# EAGLE design mic4606_power (EAGLE 6.4)

## Sheet 1 of 3
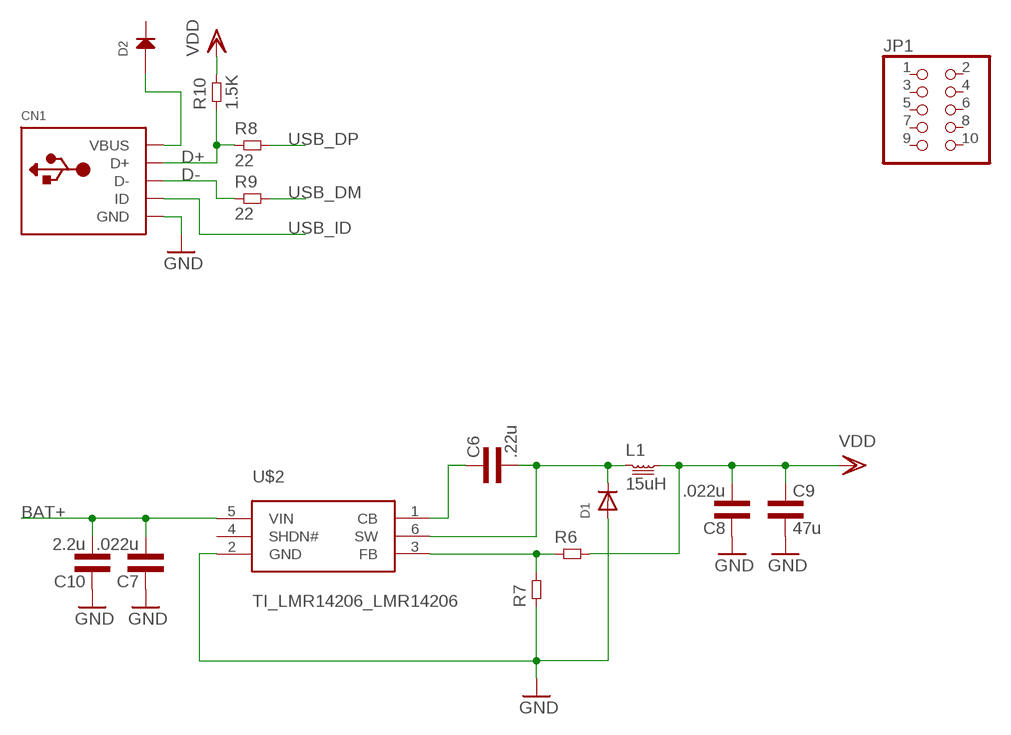
[diagram p0: schematic, sheet 1]

### Parts
C6  .22u  CAP0603L3  [0603L3]
C7  .022u  CAP0603L3  [0603L3]
C8  .022u  CAP0603L3  [0603L3]
C9  47u  CAP1210L3  [1210L3]
C10  2.2u  CAP1210L3  [1210L3]
CN1  USBMINIB  [USB-MINIB]
D1  ADAFRUIT_DIODESMA  [ADAFRUIT_SMADIODE]
D2  DIODEDO-214AC  [DO-214AC]
JP1  PINHD-2X5  [2X05]
L1  15uH  NRG4026  [NR4026]
R6  RES0603L3  [0603L3]
R7  RES0603L3  [0603L3]
R8  22  RES0402L3  [0402L3]
R9  22  RES0402L3  [0402L3]
R10  1.5K  RES0402L3  [0402L3]
U$2  TI_LMR14206_LMR14206  [TI_LMR14206_R-PDSO-G6]

### Nets
BAT+: C7.P$2 C10.P$2 U$2.5(VIN) ; also sheet 2
CB: C6.P$1 U$2.1(CB)
D+: CN1.D+ R8.P$1 R10.P$1
D-: CN1.D- R9.P$1
FB: R6.P$1 R7.P$2 U$2.3(FB)
GND: C7.P$1 C8.P$1 C9.P$2 C10.P$1 CN1.GND D1.A R7.P$1 U$2.2(GND) ; also sheet 2,3
SW: C6.P$2 D1.C L1.E U$2.6(SW)
USB_DM: R9.P$2 ; also sheet 3
USB_DP: R8.P$2 ; also sheet 3
USB_ID: CN1.ID ; also sheet 3
VBUS: CN1.VBUS D2.1(ANODE)
VDD: C8.P$2 C9.P$1 L1.F R6.P$2 R10.P$2 ; also sheet 3
Unconnected: D2.2(CATHODE) JP1.1 JP1.2 JP1.3 JP1.4 JP1.5 JP1.6 JP1.7 JP1.8 JP1.9 JP1.10 U$2.4(SHDN#)

## Sheet 2 of 3
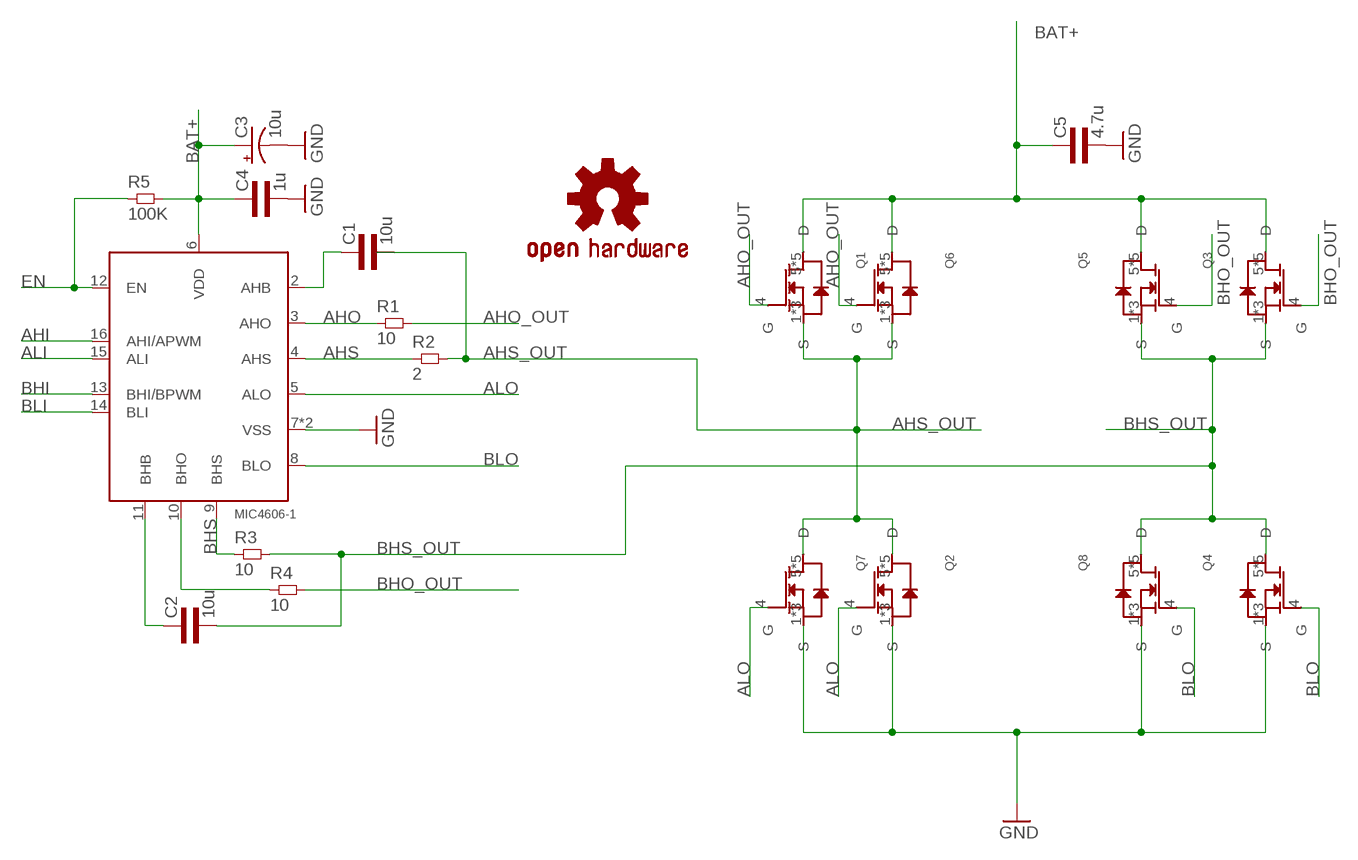
[diagram p1: schematic, sheet 2]

### Parts
C1  10u  CAP0805L3  [0805L3]
C2  10u  CAP0805L3  [0805L3]
C3  10u  CPOL-USE1.8-4  [E1,8-4]
C4  1u  CAP0603L3  [0603L3]
C5  4.7u  CAP0805L3  [0805L3]
LOGO1  OSHW-LOGOM  [OSHW-LOGO-M]
MD1  MIC4606-1  [QFN44-16LD-PL-2]
Q1  CSD18540Q5B  [Q5B]
Q2  CSD18540Q5B  [Q5B]
Q3  CSD18540Q5B  [Q5B]
Q4  CSD18540Q5B  [Q5B]
Q5  CSD18540Q5B  [Q5B]
Q6  CSD18540Q5B  [Q5B]
Q7  CSD18540Q5B  [Q5B]
Q8  CSD18540Q5B  [Q5B]
R1  10  RES0805L3  [0805L3]
R2  2  RES0805L3  [0805L3]
R3  10  RES0805L3  [0805L3]
R4  10  RES0805L3  [0805L3]
R5  100K  RES0603L3  [0603L3]

### Nets
AHI: MD1.16(AHI/APWM)
AHO: MD1.3(AHO) R1.1
AHO_OUT: Q1.4(G) Q6.4(G) R1.2
AHS: MD1.4(AHS) R2.1
AHS_OUT: C1.2 Q1.1(S) Q1.2(S) Q1.3(S) Q2.5(D) Q2.6(D) Q2.7(D) Q2.8(D) Q2.9(D) Q6.1(S) Q6.2(S) Q6.3(S) Q7.5(D) Q7.6(D) Q7.7(D) Q7.8(D) Q7.9(D) R2.2
ALI: MD1.15(ALI)
ALO: MD1.5(ALO) Q2.4(G) Q7.4(G)
BAT+: C3.+ C4.P$1 C5.1 MD1.6(VDD) Q1.5(D) Q1.6(D) Q1.7(D) Q1.8(D) Q1.9(D) Q3.5(D) Q3.6(D) Q3.7(D) Q3.8(D) Q3.9(D) Q5.5(D) Q5.6(D) Q5.7(D) Q5.8(D) Q5.9(D) Q6.5(D) Q6.6(D) Q6.7(D) Q6.8(D) Q6.9(D) R5.P$2 ; also sheet 1
BHI: MD1.13(BHI/BPWM)
BHO: MD1.10(BHO) R4.1
BHO_OUT: Q3.4(G) Q5.4(G) R4.2
BHS: MD1.9(BHS) R3.1
BHS_OUT: C2.2 Q3.1(S) Q3.2(S) Q3.3(S) Q4.5(D) Q4.6(D) Q4.7(D) Q4.8(D) Q4.9(D) Q5.1(S) Q5.2(S) Q5.3(S) Q8.5(D) Q8.6(D) Q8.7(D) Q8.8(D) Q8.9(D) R3.2
BLI: MD1.14(BLI)
BLO: MD1.8(BLO) Q4.4(G) Q8.4(G)
EN: MD1.12(EN) R5.P$1
GND: C3.- C4.P$2 C5.2 MD1.7(VSS) MD1.TP(VSS) Q2.1(S) Q2.2(S) Q2.3(S) Q4.1(S) Q4.2(S) Q4.3(S) Q7.1(S) Q7.2(S) Q7.3(S) Q8.1(S) Q8.2(S) Q8.3(S) ; also sheet 1,3
N$1: C1.1 MD1.2(AHB)
N$9: C2.1 MD1.11(BHB)

## Sheet 3 of 3
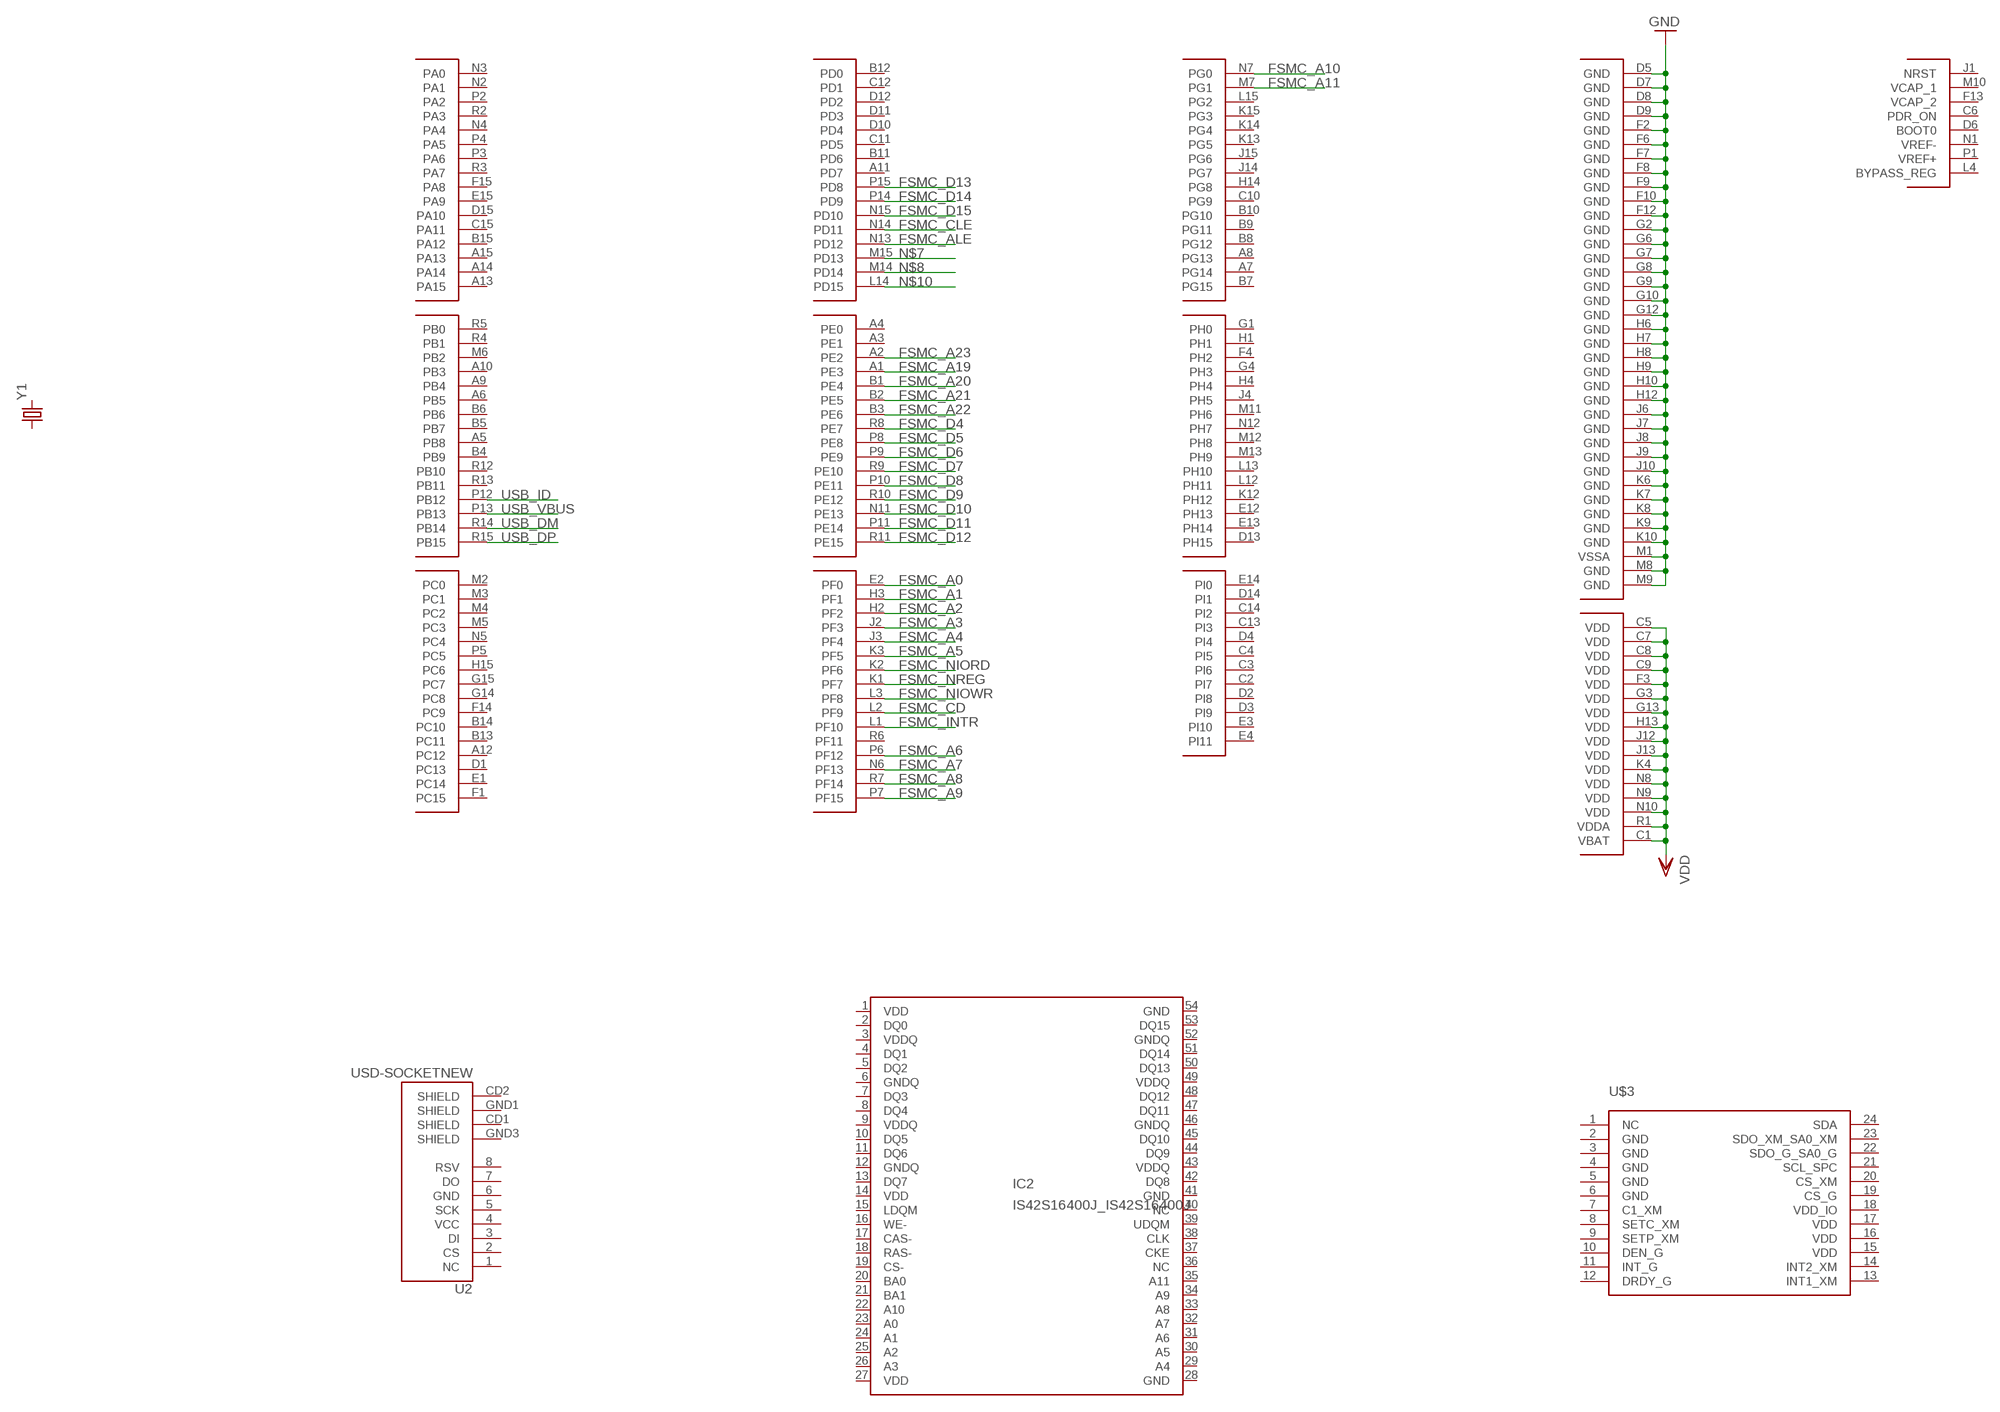
[diagram p2: schematic, sheet 3]

### Parts
IC2  IS42S16400J_IS42S16400J  [IS42S16400J_TSOP-2]
U2  USD-SOCKETNEW  [MICRO-SD-SOCKET-PP]
U$3  ST_LSM9DS0_TEMP_SENSE_LSM9DS0  [ST_LSM9DS0_TEMP_SENSE_LGA-24]
U$4  STM32_32BIT_MCU_STM32F407IG  [STM32_32BIT_MCU_UFBGA176+25]
Y1  CRYSTALHC49US  [HC49US]

### Nets
FSMC_A0: U$4.E2(PF0)
FSMC_A1: U$4.H3(PF1)
FSMC_A2: U$4.H2(PF2)
FSMC_A3: U$4.J2(PF3)
FSMC_A4: U$4.J3(PF4)
FSMC_A5: U$4.K3(PF5)
FSMC_A6: U$4.P6(PF12)
FSMC_A7: U$4.N6(PF13)
FSMC_A8: U$4.R7(PF14)
FSMC_A9: U$4.P7(PF15)
FSMC_A10: U$4.N7(PG0)
FSMC_A11: U$4.M7(PG1)
FSMC_A19: U$4.A1(PE3)
FSMC_A20: U$4.B1(PE4)
FSMC_A21: U$4.B2(PE5)
FSMC_A22: U$4.B3(PE6)
FSMC_A23: U$4.A2(PE2)
FSMC_ALE: U$4.N13(PD12)
FSMC_CD: U$4.L2(PF9)
FSMC_CLE: U$4.N14(PD11)
FSMC_D4: U$4.R8(PE7)
FSMC_D5: U$4.P8(PE8)
FSMC_D6: U$4.P9(PE9)
FSMC_D7: U$4.R9(PE10)
FSMC_D8: U$4.P10(PE11)
FSMC_D9: U$4.R10(PE12)
FSMC_D10: U$4.N11(PE13)
FSMC_D11: U$4.P11(PE14)
FSMC_D12: U$4.R11(PE15)
FSMC_D13: U$4.P15(PD8)
FSMC_D14: U$4.P14(PD9)
FSMC_D15: U$4.N15(PD10)
FSMC_INTR: U$4.L1(PF10)
FSMC_NIORD: U$4.K2(PF6)
FSMC_NIOWR: U$4.L3(PF8)
FSMC_NREG: U$4.K1(PF7)
GND: U$4.D5(GND) U$4.D7(GND) U$4.D8(GND) U$4.D9(GND) U$4.F2(GND) U$4.F6(GND) U$4.F7(GND) U$4.F8(GND) U$4.F9(GND) U$4.F10(GND) U$4.F12(GND) U$4.G2(GND) U$4.G6(GND) U$4.G7(GND) U$4.G8(GND) U$4.G9(GND) U$4.G10(GND) U$4.G12(GND) U$4.H6(GND) U$4.H7(GND) U$4.H8(GND) U$4.H9(GND) U$4.H10(GND) U$4.H12(GND) U$4.J6(GND) U$4.J7(GND) U$4.J8(GND) U$4.J9(GND) U$4.J10(GND) U$4.K6(GND) U$4.K7(GND) U$4.K8(GND) U$4.K9(GND) U$4.K10(GND) U$4.M1(VSSA) U$4.M8(GND) U$4.M9(GND) ; also sheet 1,2
N$7: U$4.M15(PD13)
N$8: U$4.M14(PD14)
N$10: U$4.L14(PD15)
USB_DM: U$4.R14(PB14) ; also sheet 1
USB_DP: U$4.R15(PB15) ; also sheet 1
USB_ID: U$4.P12(PB12) ; also sheet 1
USB_VBUS: U$4.P13(PB13)
VDD: U$4.C1(VBAT) U$4.C5(VDD) U$4.C7(VDD) U$4.C8(VDD) U$4.C9(VDD) U$4.F3(VDD) U$4.G3(VDD) U$4.G13(VDD) U$4.H13(VDD) U$4.J12(VDD) U$4.J13(VDD) U$4.K4(VDD) U$4.N8(VDD) U$4.N9(VDD) U$4.N10(VDD) U$4.R1(VDDA) ; also sheet 1
Unconnected: IC2.2(DQ0) IC2.4(DQ1) IC2.5(DQ2) IC2.7(DQ3) IC2.8(DQ4) IC2.10(DQ5) IC2.11(DQ6) IC2.13(DQ7) IC2.15(LDQM) IC2.16(WE-) IC2.17(CAS-) IC2.18(RAS-) IC2.19(CS-) IC2.20(BA0) IC2.21(BA1) IC2.22(A10) IC2.23(A0) IC2.24(A1) IC2.25(A2) IC2.26(A3) IC2.29(A4) IC2.30(A5) IC2.31(A6) IC2.32(A7) IC2.33(A8) IC2.34(A9) IC2.35(A11) IC2.36(NC) IC2.37(CKE) IC2.38(CLK) IC2.39(UDQM) IC2.40(NC) IC2.42(DQ8) IC2.44(DQ9) IC2.45(DQ10) IC2.47(DQ11) IC2.48(DQ12) IC2.50(DQ13) IC2.51(DQ14) IC2.53(DQ15) U2.1(NC) U2.2(CS) U2.3(DI) U2.4(VCC) U2.5(SCK) U2.6(GND) U2.7(DO) U2.8(RSV) U2.CD1(SHIELD) U2.CD2(SHIELD) U2.GND1(SHIELD) U2.GND3(SHIELD) U$3.1(NC) U$3.2(GND) U$3.3(GND) U$3.4(GND) U$3.5(GND) U$3.6(GND) U$3.7(C1_XM) U$3.8(SETC_XM) U$3.9(SETP_XM) U$3.10(DEN_G) U$3.11(INT_G) U$3.12(DRDY_G) U$3.13(INT1_XM) U$3.14(INT2_XM) U$3.15(VDD) U$3.16(VDD) U$3.17(VDD) U$3.18(VDD_IO) U$3.19(CS_G) U$3.20(CS_XM) U$3.21(SCL_SPC) U$3.22(SDO_G_SA0_G) U$3.23(SDO_XM_SA0_XM) U$3.24(SDA) U$4.A3(PE1) U$4.A4(PE0) U$4.A5(PB8) U$4.A6(PB5) U$4.A7(PG14) U$4.A8(PG13) U$4.A9(PB4) U$4.A10(PB3) U$4.A11(PD7) U$4.A12(PC12) U$4.A13(PA15) U$4.A14 U$4.A15(PA13) U$4.B4(PB9) U$4.B5(PB7) U$4.B6 U$4.B7(PG15) U$4.B8(PG12) U$4.B9(PG11) U$4.B10(PG10) U$4.B11(PD6) U$4.B12(PD0) U$4.B13(PC11) U$4.B14(PC10) U$4.B15(PA12) U$4.C2(PI7) U$4.C3(PI6) U$4.C4(PI5) U$4.C6(PDR_ON) U$4.C10(PG9) U$4.C11(PD5) U$4.C12(PD1) U$4.C13(PI3) U$4.C14(PI2) U$4.C15(PA11) U$4.D1(PC13) U$4.D2(PI8) U$4.D3(PI9) U$4.D4(PI4) U$4.D6(BOOT0) U$4.D10(PD4) U$4.D11(PD3) U$4.D12(PD2) U$4.D13(PH15) U$4.D14(PI1) U$4.D15(PA10) U$4.E1(PC14) U$4.E3(PI10) U$4.E4(PI11) U$4.E12(PH13) U$4.E13(PH14) U$4.E14(PI0) U$4.E15(PA9) U$4.F1(PC15) U$4.F4(PH2) U$4.F13(VCAP_2) U$4.F14(PC9) U$4.F15(PA8) U$4.G1(PH0) U$4.G4(PH3) U$4.G14(PC8) U$4.G15(PC7) U$4.H1 U$4.H4 U$4.H14(PG8) U$4.H15(PC6) U$4.J1(NRST) U$4.J4(PH5) U$4.J14(PG7) U$4.J15(PG6) U$4.K12(PH12) U$4.K13(PG5) U$4.K14(PG4) U$4.K15(PG3) U$4.L4(BYPASS_REG) U$4.L12(PH11) U$4.L13(PH10) U$4.L15(PG2) U$4.M2(PC0) U$4.M3(PC1) U$4.M4(PC2) U$4.M5(PC3) U$4.M6(PB2) U$4.M10(VCAP_1) U$4.M11(PH6) U$4.M12(PH8) U$4.M13(PH9) U$4.N1(VREF-) U$4.N2(PA1) U$4.N3(PA0) U$4.N4(PA4) U$4.N5(PC4) U$4.N12(PH7) U$4.P1(VREF+) U$4.P2(PA2) U$4.P3(PA6) U$4.P4(PA5) U$4.P5(PC5) U$4.R2(PA3) U$4.R3(PA7) U$4.R4(PB1) U$4.R5(PB0) U$4.R6(PF11) U$4.R12(PB10) U$4.R13(PB11) Y1.1 Y1.2

## Power pins joined to a net without a drawn wire
GND: IC2.28(GND) IC2.41(GND) IC2.54(GND)
GNDQ: IC2.6(GNDQ) IC2.12(GNDQ) IC2.46(GNDQ) IC2.52(GNDQ)
VDD: IC2.1(VDD) IC2.14(VDD) IC2.27(VDD)
VDDQ: IC2.3(VDDQ) IC2.9(VDDQ) IC2.43(VDDQ) IC2.49(VDDQ)

## Library data of the parts
C1 C2 C4-C10 = common:CAP
C3 = rcl:CPOL-US: POLARIZED CAPACITOR, American symbol
CN1 = adafruit:USB: USB Connectors USBMINIB - Surface Mount Female Mini-B USB Connector 4UConnector: 06564 By microbuilder.eu Thru-hole RA Female Mini-B USB Connector 4UConnector: 18732 By ladyada.net
D1 = logic_vB:ADAFRUIT_DIODE: Diode SMADIODE - SMA Surface Mount Package 20V 1A Schottky Diode Digikey: 641-1014-6-ND DO-1N4148 - Through Hole Small Current Diode SOD-123 20V 1 A (.5mV Vf) Schottky Diode - Digikey: MBRX120TPMSCT-ND SOD-323 10V 570mA (.38mV Vf, 3ns) Schottky Diode - Digikey: ZLLS410CT-ND SOD-523 30V 30mA Schottky Diode (RB751S-40TE61) - Digikey: RB751S-40TE61CT-ND SOT23-R/W - SOT23 Package (R = Solder Paste/Reflow Ovens, W = Hand-Soldering) BAT54Film 40V 300mA - Digikey: 497-7162-1-ND
D2 = common:DIODE
IC2 = Logic - Copy:IS42S16400J_IS42S16400J: edit this description Auto generated by make-symbol-device-package-bsdl.ulp Rev. 43 Source:
JP1 = pinhead:PINHD-2X5: PIN HEADER
L1 = common:NRG4026
LOGO1 = SparkFun-Aesthetics:OSHW-LOGO: Open Source Hardware Logo This logo indicates the piece of hardware it is found on incorporates a OSHW license and/or adheres to the definition of open source hardware found here: http://freedomdefined.org/OSHW
MD1 = common:MIC4606: 85V Full-Bridge Mosfet Driver
Q1-Q8 = common:CSD18540Q5B: N-Channel High-Power MosFET; I_MAX: 221A; PD: 195W; PULSED_DRAIN_CURRENT: 400A; VGS: +/- 20V; V_MAX: 60V
R1-R10 = common:RES
U2 = SparkFun-Connectors:USD-SOCKET: microSD Socket Push-push type uSD socket. Schematic element and footprint production proven. Spark Fun Electronics SKU : PRT-00127. tDoc lines correctly indicate media card edge positions when inserting (unlocked, locked, depressed).
U$2 = logic_vB:TI_LMR14206_LMR14206
U$3 = logic_vB:ST_LSM9DS0_TEMP_SENSE_LSM9DS0: The LSM9DS0 is a gyro/accel/magnet sensor produced by ST.
U$4 = logic:STM32_32BIT_MCU_STM32F407IG
Y1 = SparkFun-FreqCtrl:CRYSTAL: Various standard crystals. Proven footprints. Spark Fun Electronics SKU : COM-00534

## Board
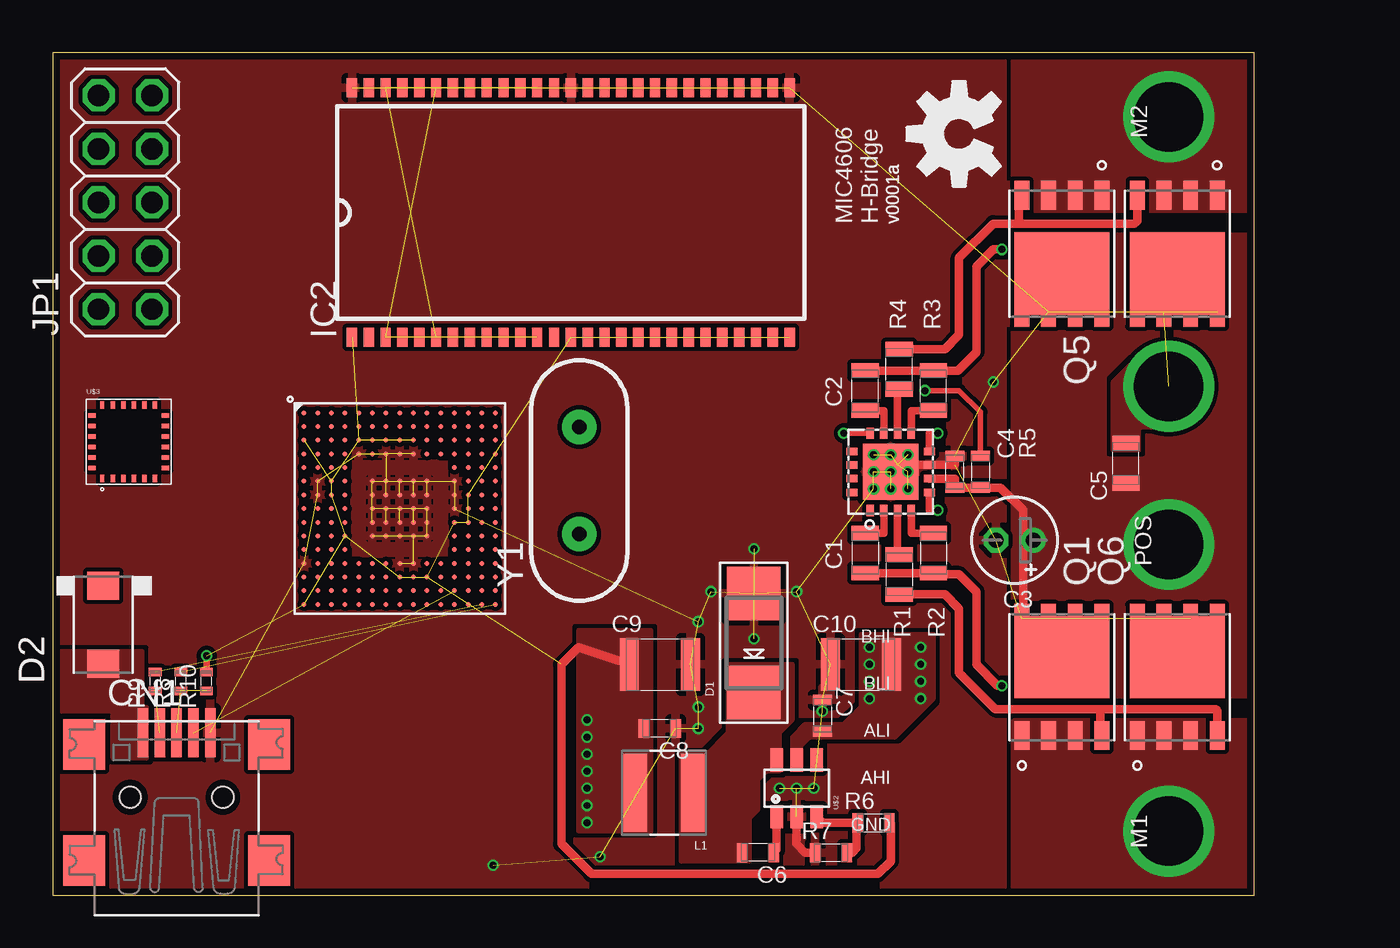
[diagram p3: board, top side]
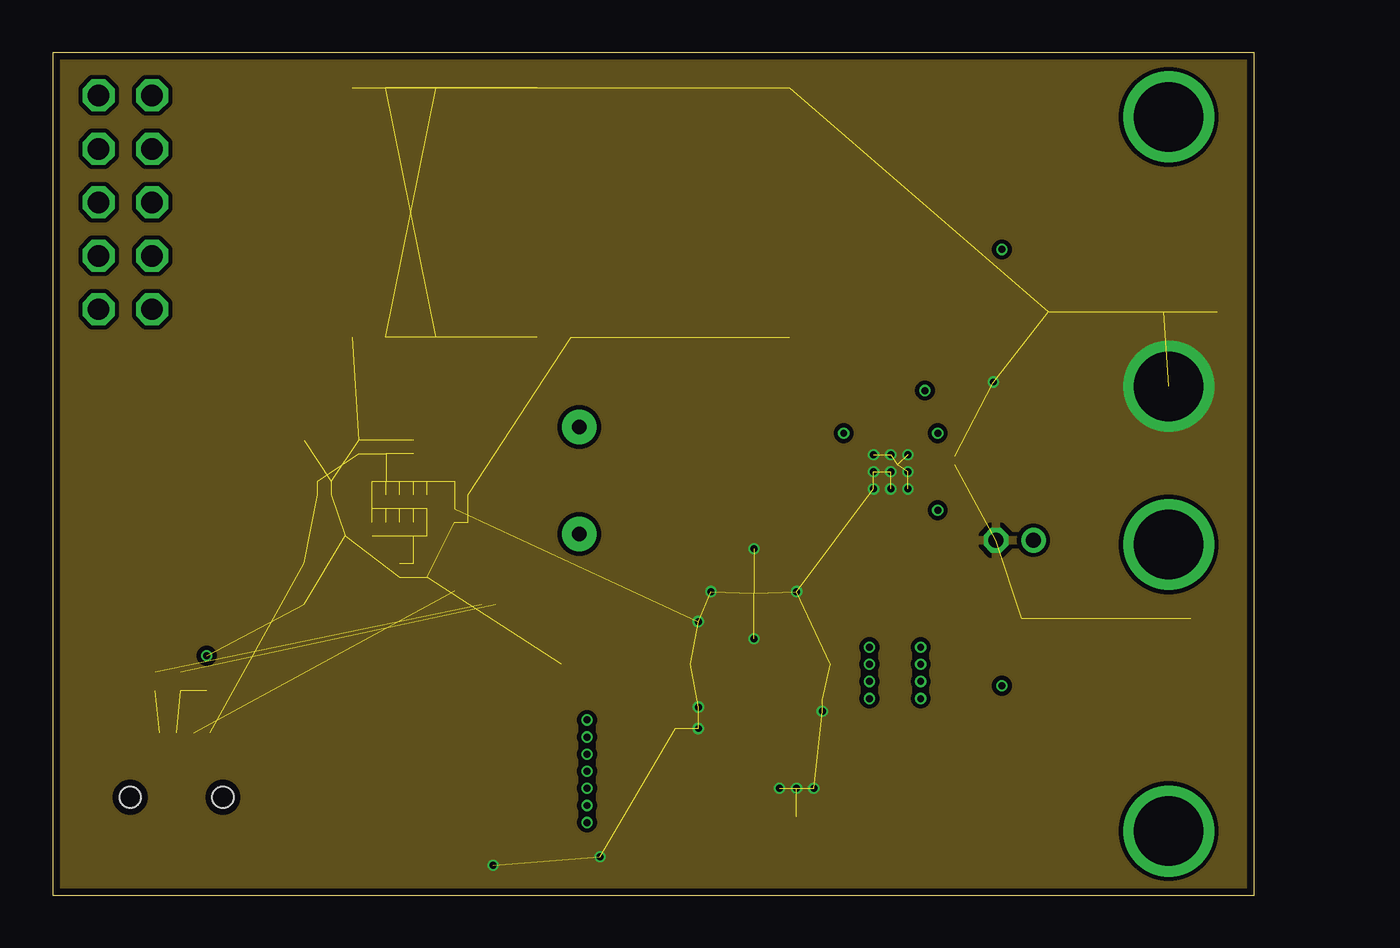
[diagram p4: board, inner layer Route2]
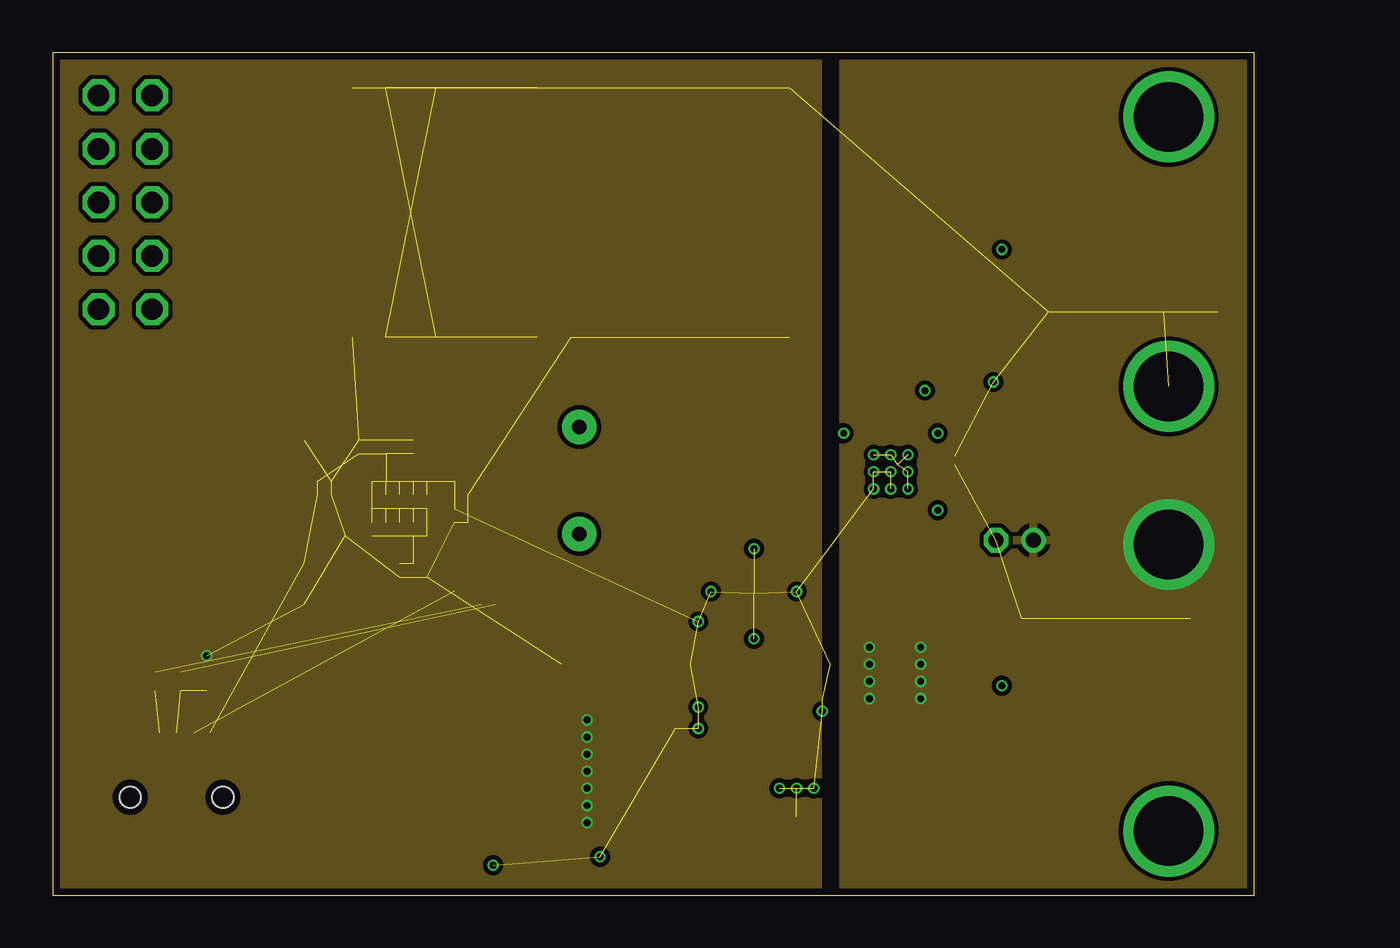
[diagram p5: board, inner layer Route3]
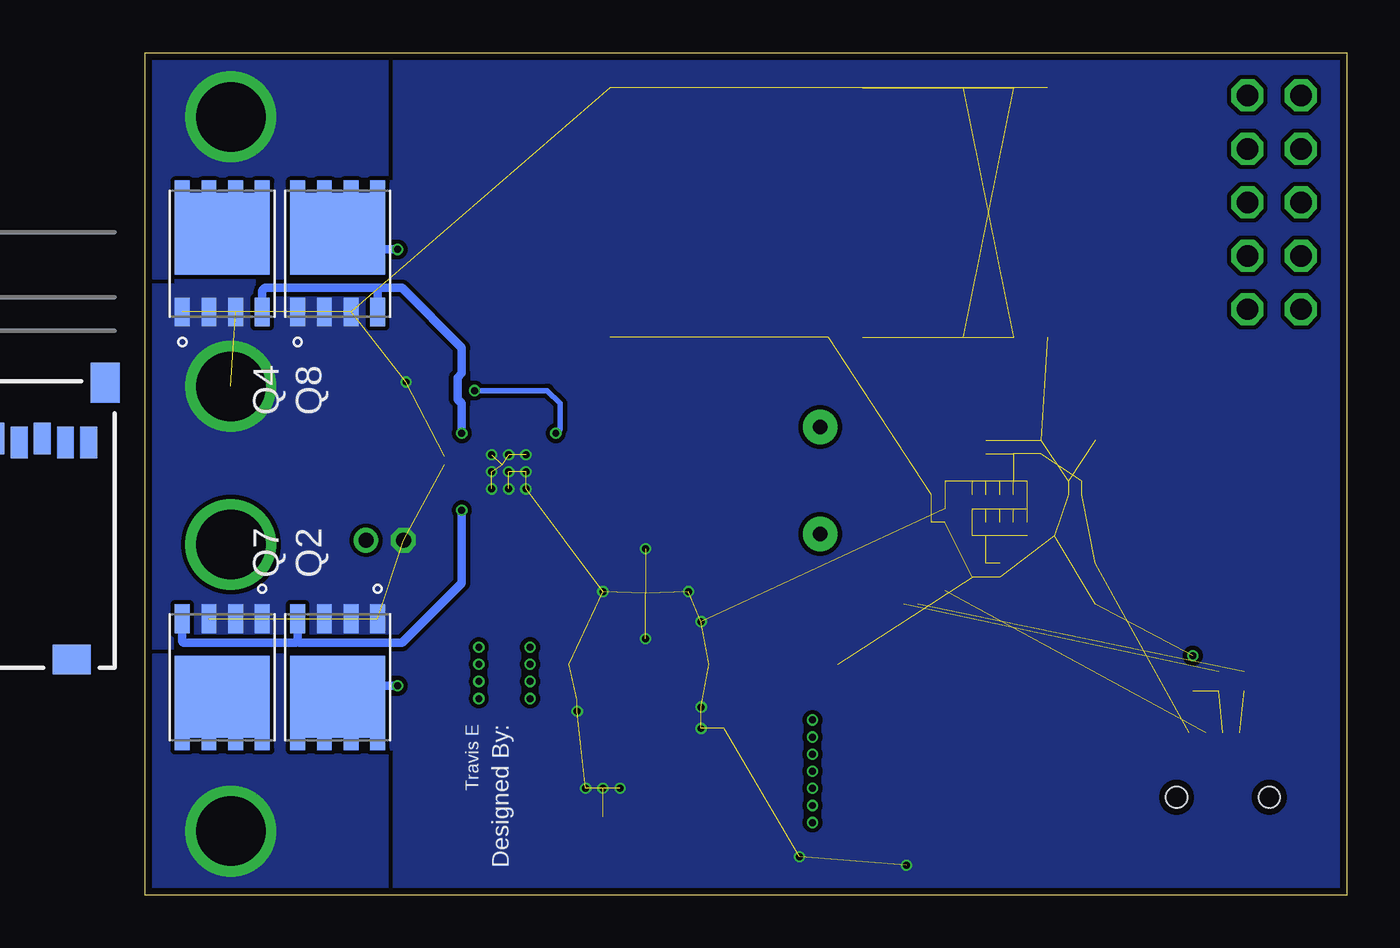
[diagram p6: board, bottom side, seen from below]

Size 57.1 x 40.03 mm. Coordinates in mm from the lower left corner, seen from the top.
Outline: 57.1,0 57.1,40.03 0,40.03 0,0 57.1,0
Copper layers (1*2*3*16): Top 0.035mm / dielectric 1.5mm / Route2 0.035mm / dielectric 0.15mm / Route3 0.035mm / dielectric 0.2mm / Bottom 0.035mm
Design rules "default *": minimum track width 5mil, minimum drill 10mil, track to track 8mil, track to pad 8mil, pad to pad 8mil, via to via 8mil, smd to smd 8mil, copper to edge 13mil, drill to drill 8mil, minimum pad ring 4mil, minimum via ring 4mil, stop-mask expansion 4mil, vias tented up to drill 13mil, thermal gap 10mil

### Footprints (pad centres in the part's own frame; a part is rotated, then mirrored left to right if it is on the bottom)
0805L3 = smd 0.7 x 1.3: 1 -0.95,0; 2 0.95,0
E1,8-4 = drill 0.711 pad 1.168: + -0.889,0 | drill 0.711 pad 1.168 octagon: - 0.889,0
0603L3 = smd 0.5 x 0.9: P$1 -0.75,0; P$2 0.75,0
1210L3 = smd 0.9 x 2.5: P$1 -1.45,0; P$2 1.45,0
USB-MINIB = smd 0.5 x 2.308: D+ 0,4.064; D- -0.8,4.064; GND 1.6,4.064; ID 0.8,4.064; VBUS -1.6,4.064 | smd 2 x 2.4: GND1 -4.4,-2; GND2 -4.4,3.5; GND3 4.4,3.5; GND4 4.4,-2 | hole 1: -2.2,1; 2.2,1
ADAFRUIT_SMADIODE = smd 2.54 x 2.54: A 2.349,0; C -2.349,0
DO-214AC = smd 1.32 x 1.52: 1 -1.85,0; 2 1.85,0
IS42S16400J_TSOP-2 = smd 0.9 x 0.49: 1 -5.93,10.4; 2 -5.93,9.6; 3 -5.93,8.8; 4 -5.93,8; 5 -5.93,7.2; 6 -5.93,6.4; 7 -5.93,5.6; 8 -5.93,4.8; 9 -5.93,4; 10 -5.93,3.2; 11 -5.93,2.4; 12 -5.93,1.6; 13 -5.93,0.8; 14 -5.93,0; 15 -5.93,-0.8; 16 -5.93,-1.6; 17 -5.93,-2.4; 18 -5.93,-3.2; 19 -5.93,-4; 20 -5.93,-4.8; 21 -5.93,-5.6; 22 -5.93,-6.4; 23 -5.93,-7.2; 24 -5.93,-8; 25 -5.93,-8.8; 26 -5.93,-9.6; 27 -5.93,-10.4; 28 5.93,-10.4; 29 5.93,-9.6; 30 5.93,-8.8; 31 5.93,-8; 32 5.93,-7.2; 33 5.93,-6.4; 34 5.93,-5.6; 35 5.93,-4.8; 36 5.93,-4; 37 5.93,-3.2; 38 5.93,-2.4; 39 5.93,-1.6; 40 5.93,-0.8; 41 5.93,0; 42 5.93,0.8; 43 5.93,1.6; 44 5.93,2.4; 45 5.93,3.2; 46 5.93,4; 47 5.93,4.8; 48 5.93,5.6; 49 5.93,6.4; 50 5.93,7.2; 51 5.93,8; 52 5.93,8.8; 53 5.93,9.6; 54 5.93,10.4
2X05 = drill 1.016 octagon: 1 -5.08,-1.27; 2 -5.08,1.27; 3 -2.54,-1.27; 4 -2.54,1.27; 5 0,-1.27; 6 0,1.27; 7 2.54,-1.27; 8 2.54,1.27; 9 5.08,-1.27; 10 5.08,1.27
NR4026 = smd 1.2 x 3.7: E -1.4,0; F 1.4,0
QFN44-16LD-PL-2 = smd 0.53 x 0.36: 1 -1.835,0.975; 2 -1.835,0.325; 3 -1.835,-0.325; 4 -1.835,-0.975; 9 1.835,-0.975; 10 1.835,-0.325; 11 1.835,0.325; 12 1.835,0.975 | smd 0.36 x 0.53: 5 -0.975,-1.835; 6 -0.325,-1.835; 7 0.325,-1.835; 8 0.975,-1.835; 13 0.975,1.835; 14 0.325,1.835; 15 -0.325,1.835; 16 -0.975,1.835 | smd 2.65 x 2.65: TP 0,0
Q5B = smd 1.372 x 0.71: 1 2.77,-1.905; 2 2.77,-0.635; 3 2.77,0.635; 4 2.77,1.905 | smd 0.59 x 0.71: 5 -3.161,1.905; 6 -3.161,0.635; 7 -3.161,-0.635; 8 -3.161,-1.905 | smd 3.85 x 4.52: 9 -0.941,0
0402L3 = smd 0.4 x 0.6: P$1 -0.45,0; P$2 0.45,0
MICRO-SD-SOCKET-PP = smd 0.8 x 1.5: 1 -8.94,10.7; 2 -7.84,10.3; 3 -6.74,10.7; 4 -5.64,10.9; 5 -4.54,10.7; 6 -3.44,10.9; 7 -2.34,10.7; 8 -1.24,10.7 | smd 1.8 x 1.4: CD1 -2.05,0.4; CD2 -7.75,0.4 | smd 1.4 x 1.9: GND1 -13.6,14.55; GND3 -0.45,13.55
TI_LMR14206_R-PDSO-G6 = smd 0.6 x 1.1: 1 -0.95,-1.35; 2 0,-1.35; 3 0.95,-1.35; 4 0.95,1.35; 5 0,1.35; 6 -0.95,1.35
ST_LSM9DS0_TEMP_SENSE_LGA-24 = smd 0.2 x 0.35: 1 -1.25,-1.75; 2 -0.75,-1.75; 3 -0.25,-1.75; 4 0.25,-1.75; 5 0.75,-1.75; 6 1.25,-1.75; 13 1.25,1.75; 14 0.75,1.75; 15 0.25,1.75; 16 -0.25,1.75; 17 -0.75,1.75; 18 -1.25,1.75 | smd 0.35 x 0.2: 7 1.75,-1.25; 8 1.75,-0.75; 9 1.75,-0.25; 10 1.75,0.25; 11 1.75,0.75; 12 1.75,1.25; 19 -1.75,1.25; 20 -1.75,0.75; 21 -1.75,0.25; 22 -1.75,-0.25; 23 -1.75,-0.75; 24 -1.75,-1.25
STM32_32BIT_MCU_UFBGA176+25 = smd 0.23 x 0.23: A1 -4.55,4.55; A2 -3.9,4.55; A3 -3.25,4.55; A4 -2.6,4.55; A5 -1.95,4.55; A6 -1.3,4.55; A7 -0.65,4.55; A8 0,4.55; A9 0.65,4.55; A10 1.3,4.55; A11 1.95,4.55; A12 2.6,4.55; A13 3.25,4.55; A14 3.9,4.55; A15 4.55,4.55; B1 -4.55,3.9; B2 -3.9,3.9; B3 -3.25,3.9; B4 -2.6,3.9; B5 -1.95,3.9; B6 -1.3,3.9; B7 -0.65,3.9; B8 0,3.9; B9 0.65,3.9; B10 1.3,3.9; B11 1.95,3.9; B12 2.6,3.9; B13 3.25,3.9; B14 3.9,3.9; B15 4.55,3.9; C1 -4.55,3.25; C2 -3.9,3.25; C3 -3.25,3.25; C4 -2.6,3.25; C5 -1.95,3.25; C6 -1.3,3.25; C7 -0.65,3.25; C8 0,3.25; C9 0.65,3.25; C10 1.3,3.25; C11 1.95,3.25; C12 2.6,3.25; C13 3.25,3.25; C14 3.9,3.25; C15 4.55,3.25; D1 -4.55,2.6; D2 -3.9,2.6; D3 -3.25,2.6; D4 -2.6,2.6; D5 -1.95,2.6; D6 -1.3,2.6; D7 -0.65,2.6; D8 0,2.6; D9 0.65,2.6; D10 1.3,2.6; D11 1.95,2.6; D12 2.6,2.6; D13 3.25,2.6; D14 3.9,2.6; D15 4.55,2.6; E1 -4.55,1.95; E2 -3.9,1.95; E3 -3.25,1.95; E4 -2.6,1.95; E12 2.6,1.95; E13 3.25,1.95; E14 3.9,1.95; E15 4.55,1.95; F1 -4.55,1.3; F2 -3.9,1.3; F3 -3.25,1.3; F4 -2.6,1.3; F6 -1.3,1.3; F7 -0.65,1.3; F8 0,1.3; F9 0.65,1.3; F10 1.3,1.3; F12 2.6,1.3; F13 3.25,1.3; F14 3.9,1.3; F15 4.55,1.3; G1 -4.55,0.65; G2 -3.9,0.65; G3 -3.25,0.65; G4 -2.6,0.65; G6 -1.3,0.65; G7 -0.65,0.65; G8 0,0.65; G9 0.65,0.65; G10 1.3,0.65; G12 2.6,0.65; G13 3.25,0.65; G14 3.9,0.65; G15 4.55,0.65; H1 -4.55,0; H2 -3.9,0; H3 -3.25,0; H4 -2.6,0; H6 -1.3,0; H7 -0.65,0; H8 0,0; H9 0.65,0; H10 1.3,0; H12 2.6,0; H13 3.25,0; H14 3.9,0; H15 4.55,0; J1 -4.55,-0.65; J2 -3.9,-0.65; J3 -3.25,-0.65; J4 -2.6,-0.65; J6 -1.3,-0.65; J7 -0.65,-0.65; J8 0,-0.65; J9 0.65,-0.65; J10 1.3,-0.65; J12 2.6,-0.65; J13 3.25,-0.65; J14 3.9,-0.65; J15 4.55,-0.65; K1 -4.55,-1.3; K2 -3.9,-1.3; K3 -3.25,-1.3; K4 -2.6,-1.3; K6 -1.3,-1.3; K7 -0.65,-1.3; K8 0,-1.3; K9 0.65,-1.3; K10 1.3,-1.3; K12 2.6,-1.3; K13 3.25,-1.3; K14 3.9,-1.3; K15 4.55,-1.3; L1 -4.55,-1.95; L2 -3.9,-1.95; L3 -3.25,-1.95; L4 -2.6,-1.95; L12 2.6,-1.95; L13 3.25,-1.95; L14 3.9,-1.95; L15 4.55,-1.95; M1 -4.55,-2.6; M2 -3.9,-2.6; M3 -3.25,-2.6; M4 -2.6,-2.6; M5 -1.95,-2.6; M6 -1.3,-2.6; M7 -0.65,-2.6; M8 0,-2.6; M9 0.65,-2.6; M10 1.3,-2.6; M11 1.95,-2.6; M12 2.6,-2.6; M13 3.25,-2.6; M14 3.9,-2.6; M15 4.55,-2.6; N1 -4.55,-3.25; N2 -3.9,-3.25; N3 -3.25,-3.25; N4 -2.6,-3.25; N5 -1.95,-3.25; N6 -1.3,-3.25; N7 -0.65,-3.25; N8 0,-3.25; N9 0.65,-3.25; N10 1.3,-3.25; N11 1.95,-3.25; N12 2.6,-3.25; N13 3.25,-3.25; N14 3.9,-3.25; N15 4.55,-3.25; P1 -4.55,-3.9; P2 -3.9,-3.9; P3 -3.25,-3.9; P4 -2.6,-3.9; P5 -1.95,-3.9; P6 -1.3,-3.9; P7 -0.65,-3.9; P8 0,-3.9; P9 0.65,-3.9; P10 1.3,-3.9; P11 1.95,-3.9; P12 2.6,-3.9; P13 3.25,-3.9; P14 3.9,-3.9; P15 4.55,-3.9; R1 -4.55,-4.55; R2 -3.9,-4.55; R3 -3.25,-4.55; R4 -2.6,-4.55; R5 -1.95,-4.55; R6 -1.3,-4.55; R7 -0.65,-4.55; R8 0,-4.55; R9 0.65,-4.55; R10 1.3,-4.55; R11 1.95,-4.55; R12 2.6,-4.55; R13 3.25,-4.55; R14 3.9,-4.55; R15 4.55,-4.55
HC49US = drill 0.7 pad 1.651: 1 -2.54,0; 2 2.54,0

### Placement (x,y rotation side)
C1  38.61,16.26 270 top
C2  38.61,23.98 90 top
C3  45.72,16.87 180 top
C4  42.88,20.12 90 top
C5  51,20.52 90 top
C6  33.53,2.03 180 top
C7  36.58,8.53 270 top
C8  28.85,7.92 180 top
C9  28.85,10.97 0 top
C10  38.4,10.97 0 top
CN1  5.89,3.66 0 top
D1  33.32,11.99 90 top
D2  2.4,12.85 90 top
IC2  24.63,32.43 90 top
JP1  3.45,32.92 90 top
L1  29.06,4.88 180 top
LOGO1  43.08,36.17 90 top
MD1  39.83,20.12 90 top
Q1  47.96,10.36 270 top
Q2  47.96,10.36 90 bottom
Q3  53.44,30.48 90 top
Q4  53.44,30.48 270 bottom
Q5  47.96,30.48 90 top
Q6  53.44,10.36 270 top
Q7  53.44,10.36 90 bottom
Q8  47.96,30.48 270 bottom
R1  40.23,15.24 270 top
R2  41.86,16.26 270 top
R3  41.86,23.98 90 top
R4  40.23,24.99 90 top
R5  44.09,20.12 270 top
R6  39.01,3.45 0 top
R7  36.98,2.03 0 top
R8  6.1,10.16 90 top
R9  4.88,10.16 90 top
R10  7.32,10.16 90 top
U2  58.55,10.81 0 bottom
U$2  35.36,5.08 0 top
U$3  3.61,21.54 0 top
U$4  16.49,18.37 0 top
Y1  25.03,19.71 90 top

### Tracks (layer width: path | path; a pad name or v marks a point on that pad's centre or on a via)
AHO
  Top 0.356: MD1.3 40.15,16.19
  Top 0.406: 40.15,16.19 R1.1
AHO_OUT
  Top 0.406: R1.2 42.4,14.29 43.08,13.61 43.08,10.57 44.81,8.84 49.78,8.84 | 49.78,8.84 49.78,7.67 Q1.4 | Q6.4 55.35,8.76 55.27,8.84 49.78,8.84
AHS
  Top 0.356: MD1.4 40.8,17.21 R2.1
AHS_OUT  (via drill 0.33, 3.3)
  Top 0.406: C1.2 R2.2 41.92,15.24 43.08,15.24 43.89,14.43 43.89,10.97 44.91,9.96 v45.11,9.96
  Bottom 0.406: v45.11,9.96 47.42,9.96 Q2.9
  other vias: 53.04,3.05
  pour Top (no thermals): 45.72,8.23 56.69,8.23 56.69,0.41 45.72,0.41
  pour Bottom (no thermals): 45.72,11.28 45.72,0.41 56.69,0.41 56.69,11.28
ALO  (via drill 0.33)
  Top 0.356: MD1.5 41.66,18.29 v42.06,18.29
  Bottom 0.406: Q2.4 49.86,12.06 | 49.86,12.06 49.78,11.99 44.91,11.99 42.06,14.83 v42.06,18.29 | Q7.4 55.35,12.06 55.27,11.99 49.94,11.99 49.86,12.06
BAT+  (via drill 0.33, 3.3)
  Top 0.406: MD1.6 42.87,19.79 C4.P$1 R5.P$2 45.05,19.37 46.13,18.29 46.13,13.6
  other vias: 53.04,16.66 41.25,9.35 41.25,10.16 41.25,10.97 41.25,11.79 38.81,9.35 38.81,10.16 38.81,10.97 38.81,11.79
  pour Top (rank 2, no thermals): 45.72,9.55 45.72,31.29 56.69,31.29 56.69,9.55
  pour Route3: 37.59,0.41 37.59,39.62 56.69,39.62 56.69,0.41
  pour Top (no thermals): 35.56,6.1 35.56,7.11 35.97,7.52 40.03,7.52 41.86,9.35 41.86,12.4 38.4,12.4 38.4,8.94 37.59,8.13 35.76,8.13 35.15,7.52 35.15,6.1
BHO
  Top 0.356: MD1.10 40.15,24.04
  Top 0.406: 40.15,24.04 R4.1
BHO_OUT
  Top 0.406: R4.2 42.4,25.94 43.08,26.62 43.08,30.28 44.7,31.9 45.92,31.9 | 45.92,31.9 45.92,33.12 Q5.4 | Q3.4 51.54,32.03 51.41,31.9 45.92,31.9
BHS
  Top 0.356: MD1.9 40.8,23.03 R3.1
BHS_OUT  (via drill 0.33, 3.3)
  Top 0.406: C2.2 R3.2 43.01,24.93 43.89,25.81 43.89,29.87 44.7,30.68 v45.11,30.68
  Bottom 0.406: v45.11,30.68 47.22,30.68 Q8.9
  other vias: 53.04,36.98
  pour Top (no thermals): 45.72,32.61 56.69,32.61 56.69,39.62 45.72,39.62
  pour Bottom (no thermals): 45.72,29.46 56.69,29.46 56.69,39.62 45.72,39.62
BLO  (via drill 0.33)
  Top 0.356: MD1.8 41.66,21.95 v42.06,21.95
  Bottom 0.406: Q4.4 51.54,28.73 51.41,28.85 46.13,28.85 | 46.13,28.85 44.91,28.85 42.06,26.01 42.06,24.79 42.27,24.59 42.27,23.57 42.06,23.37 v42.06,21.95 | Q8.4 46.05,28.78 46.13,28.85
CB
  Top 0.406: U$2.1 34.41,2.16 C6.P$1
D+  (2 unrouted)
D-  (1 unrouted)
EN  (via drill 0.33)
  Top 0.254: R5.P$1 44.09,22.96 43.08,23.98 v41.45,23.98 | v37.59,21.95 MD1.12
  Bottom 0.254: v41.45,23.98 38,23.98 37.39,23.37 37.39,22.15 v37.59,21.95
FB
  Top 0.406: R7.P$2 38,2.03 38.2,2.23 38.2,3.39 R6.P$1 36.58,3.45 U$2.3
GND  (via drill 0.33, 3.3)  (83 unrouted)
  Top 0.254: 40.15,20.44 MD1.TP
  Top 0.406: C4.P$2 42.87,20.44 MD1.7 40.15,20.44 | U$2.2 35.36,2.44 35.76,2.03 R7.P$1
  other vias: 53.04,24.18 39.01,19.3 39.01,20.12 39.01,20.93 39.83,19.3 39.83,20.12 39.83,20.93 40.64,19.3 40.64,20.12 40.64,20.93 20.93,1.42 30.68,8.94 30.68,13 30.68,7.92 33.32,12.19 31.29,14.43 33.32,16.46 35.36,14.43 34.54,5.08 35.36,5.08 36.17,5.08 26.01,1.83 44.7,24.38 36.58,8.74
  pour Bottom (rank 6, no thermals): 0.41,0.41 0.41,39.62 56.69,39.62 56.69,0.41
  pour Top (rank 6): 0.41,0.41 0.41,39.62 56.69,39.62 56.69,0.41
  pour Top (no thermals): 51.61,21.13 51.61,22.15 52.43,22.96 54.05,22.96 54.05,25.4 51.41,25.4 50.39,24.38 50.39,21.13
  pour Route2: 0.41,0.41 0.41,39.62 56.69,39.62 56.69,0.41
GNDQ  (3 unrouted)
N$1
  Top 0.356: MD1.2 39.5,17.21 C1.1
N$9
  Top 0.356: MD1.11 39.5,23.03 C2.1
SW
  pour Top (no thermals): 34.54,5.89 34.54,7.72 35.15,8.33 35.15,10.97 32.11,10.97 32.11,7.72 31.09,6.71 29.87,6.71 29.87,1.63 33.12,1.63 33.12,3.66 33.53,4.06 33.53,5.49 33.93,5.89
USB_DM  (1 unrouted)
USB_DP  (1 unrouted)
USB_ID  (1 unrouted)
VBUS
  pour Top (no thermals): 4.47,6.5 2.84,6.5 2.84,8.74 0.41,8.74 0.41,11.58 4.27,11.58 4.27,8.94 4.47,8.94
VDD  (via drill 0.33)  (20 unrouted)
  Top 0.305: R10.P$2 v7.31,11.38
  Top 0.406: C9.P$1 24.99,11.79 24.18,10.97 24.18,2.44 25.6,1.02 39.22,1.02 39.83,1.63 39.83,3.39 R6.P$2
  Bottom 0.305: 25.41,8.34 v25.4,8.33
  other vias: 25.4,3.45 25.4,4.27 25.4,5.08 25.4,5.89 25.4,6.71 25.4,7.52
  pour Top (no thermals): 28.45,3.05 24.99,3.05 24.99,12.6 28.45,12.6
  pour Route3: 0.41,0.41 0.41,39.62 36.37,39.62 36.37,0.41
VDDQ  (3 unrouted)

### Text on the board
tPlace: M2 | MIC4606 | H-Bridge | v0001a | v0001a | v0001a | POS | BHI | BLI | ALI | AHI | AHI | GND | M1
bPlace: Designed By: | Travis E